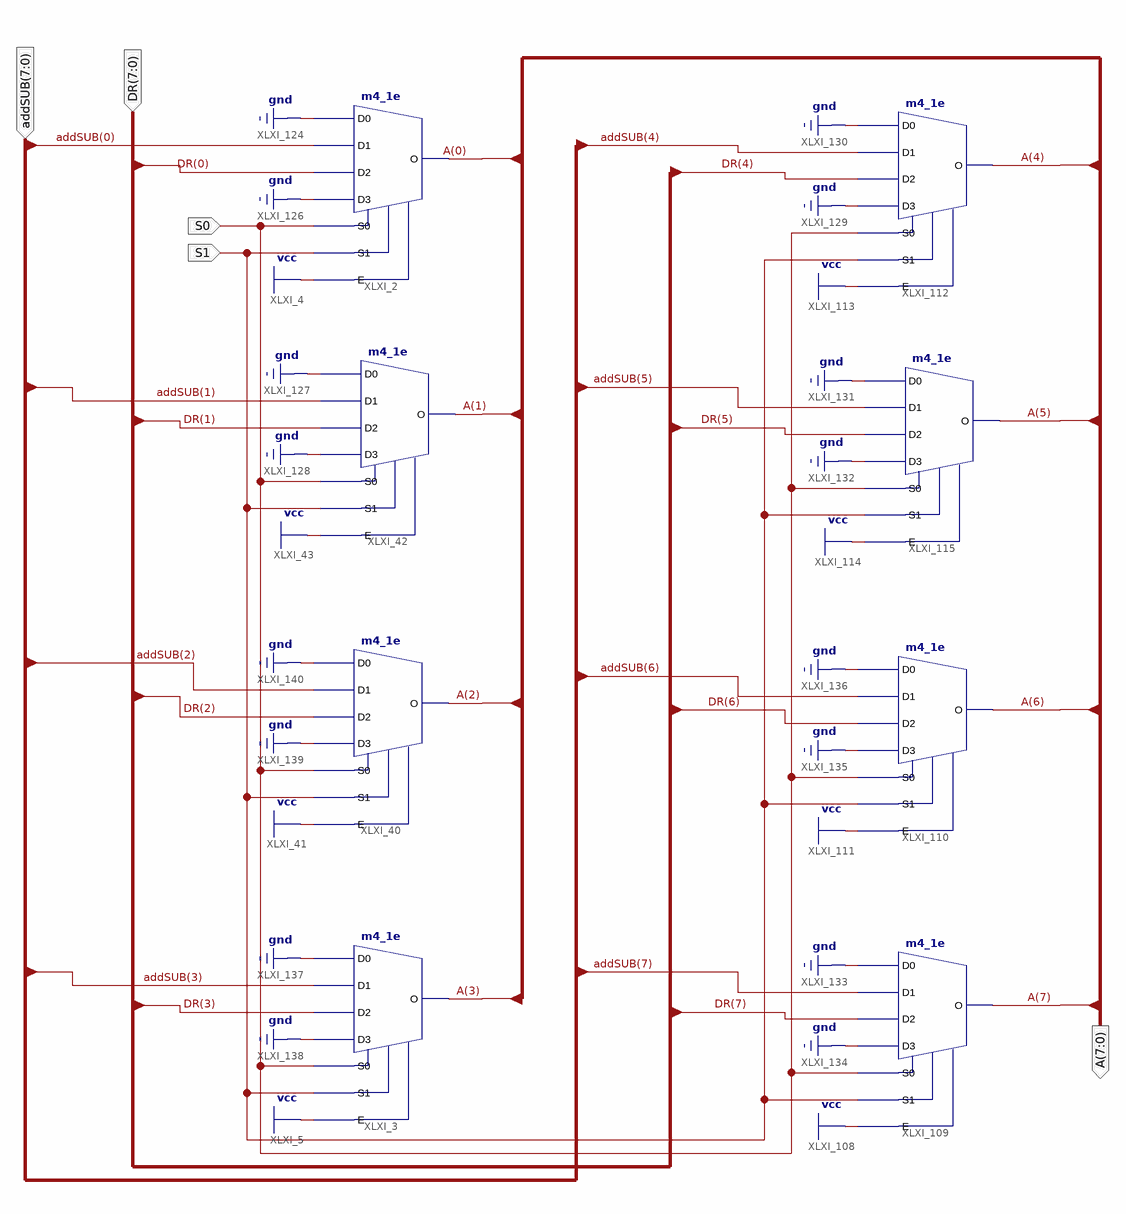
[diagram p0: schematic sheet 1]
// Xilinx ISE schematic muxA.sch (spartan3e) as structural Verilog: 8 symbols, 5 ports
module muxA (
  input  [7:0] addSUB,
  input  [7:0] DR,
  input  S1,
  input  S0,
  output [7:0] A
);

  m4_1e XLXI_109 (.D0(1'b0), .D1(addSUB[7]), .D2(DR[7]), .D3(1'b0), .E(1'b1), .S0(S0), .S1(S1), .O(A[7]));
  m4_1e XLXI_110 (.D0(1'b0), .D1(addSUB[6]), .D2(DR[6]), .D3(1'b0), .E(1'b1), .S0(S0), .S1(S1), .O(A[6]));
  m4_1e XLXI_112 (.D0(1'b0), .D1(addSUB[4]), .D2(DR[4]), .D3(1'b0), .E(1'b1), .S0(S0), .S1(S1), .O(A[4]));
  m4_1e XLXI_115 (.D0(1'b0), .D1(addSUB[5]), .D2(DR[5]), .D3(1'b0), .E(1'b1), .S0(S0), .S1(S1), .O(A[5]));
  m4_1e XLXI_3 (.D0(1'b0), .D1(addSUB[3]), .D2(DR[3]), .D3(1'b0), .E(1'b1), .S0(S0), .S1(S1), .O(A[3]));
  m4_1e XLXI_40 (.D0(1'b0), .D1(addSUB[2]), .D2(DR[2]), .D3(1'b0), .E(1'b1), .S0(S0), .S1(S1), .O(A[2]));
  m4_1e XLXI_2 (.D0(1'b0), .D1(addSUB[0]), .D2(DR[0]), .D3(1'b0), .E(1'b1), .S0(S0), .S1(S1), .O(A[0]));
  m4_1e XLXI_42 (.D0(1'b0), .D1(addSUB[1]), .D2(DR[1]), .D3(1'b0), .E(1'b1), .S0(S0), .S1(S1), .O(A[1]));
endmodule
